# EasyEDA schematic SCH_PCB-micropad_2024-07-07.json
TITLE: Sheet_1; REV: 1.0; Date: 2024-07-03; Sheet: 1/1; Drawn By: projachmann; Company: Your Company
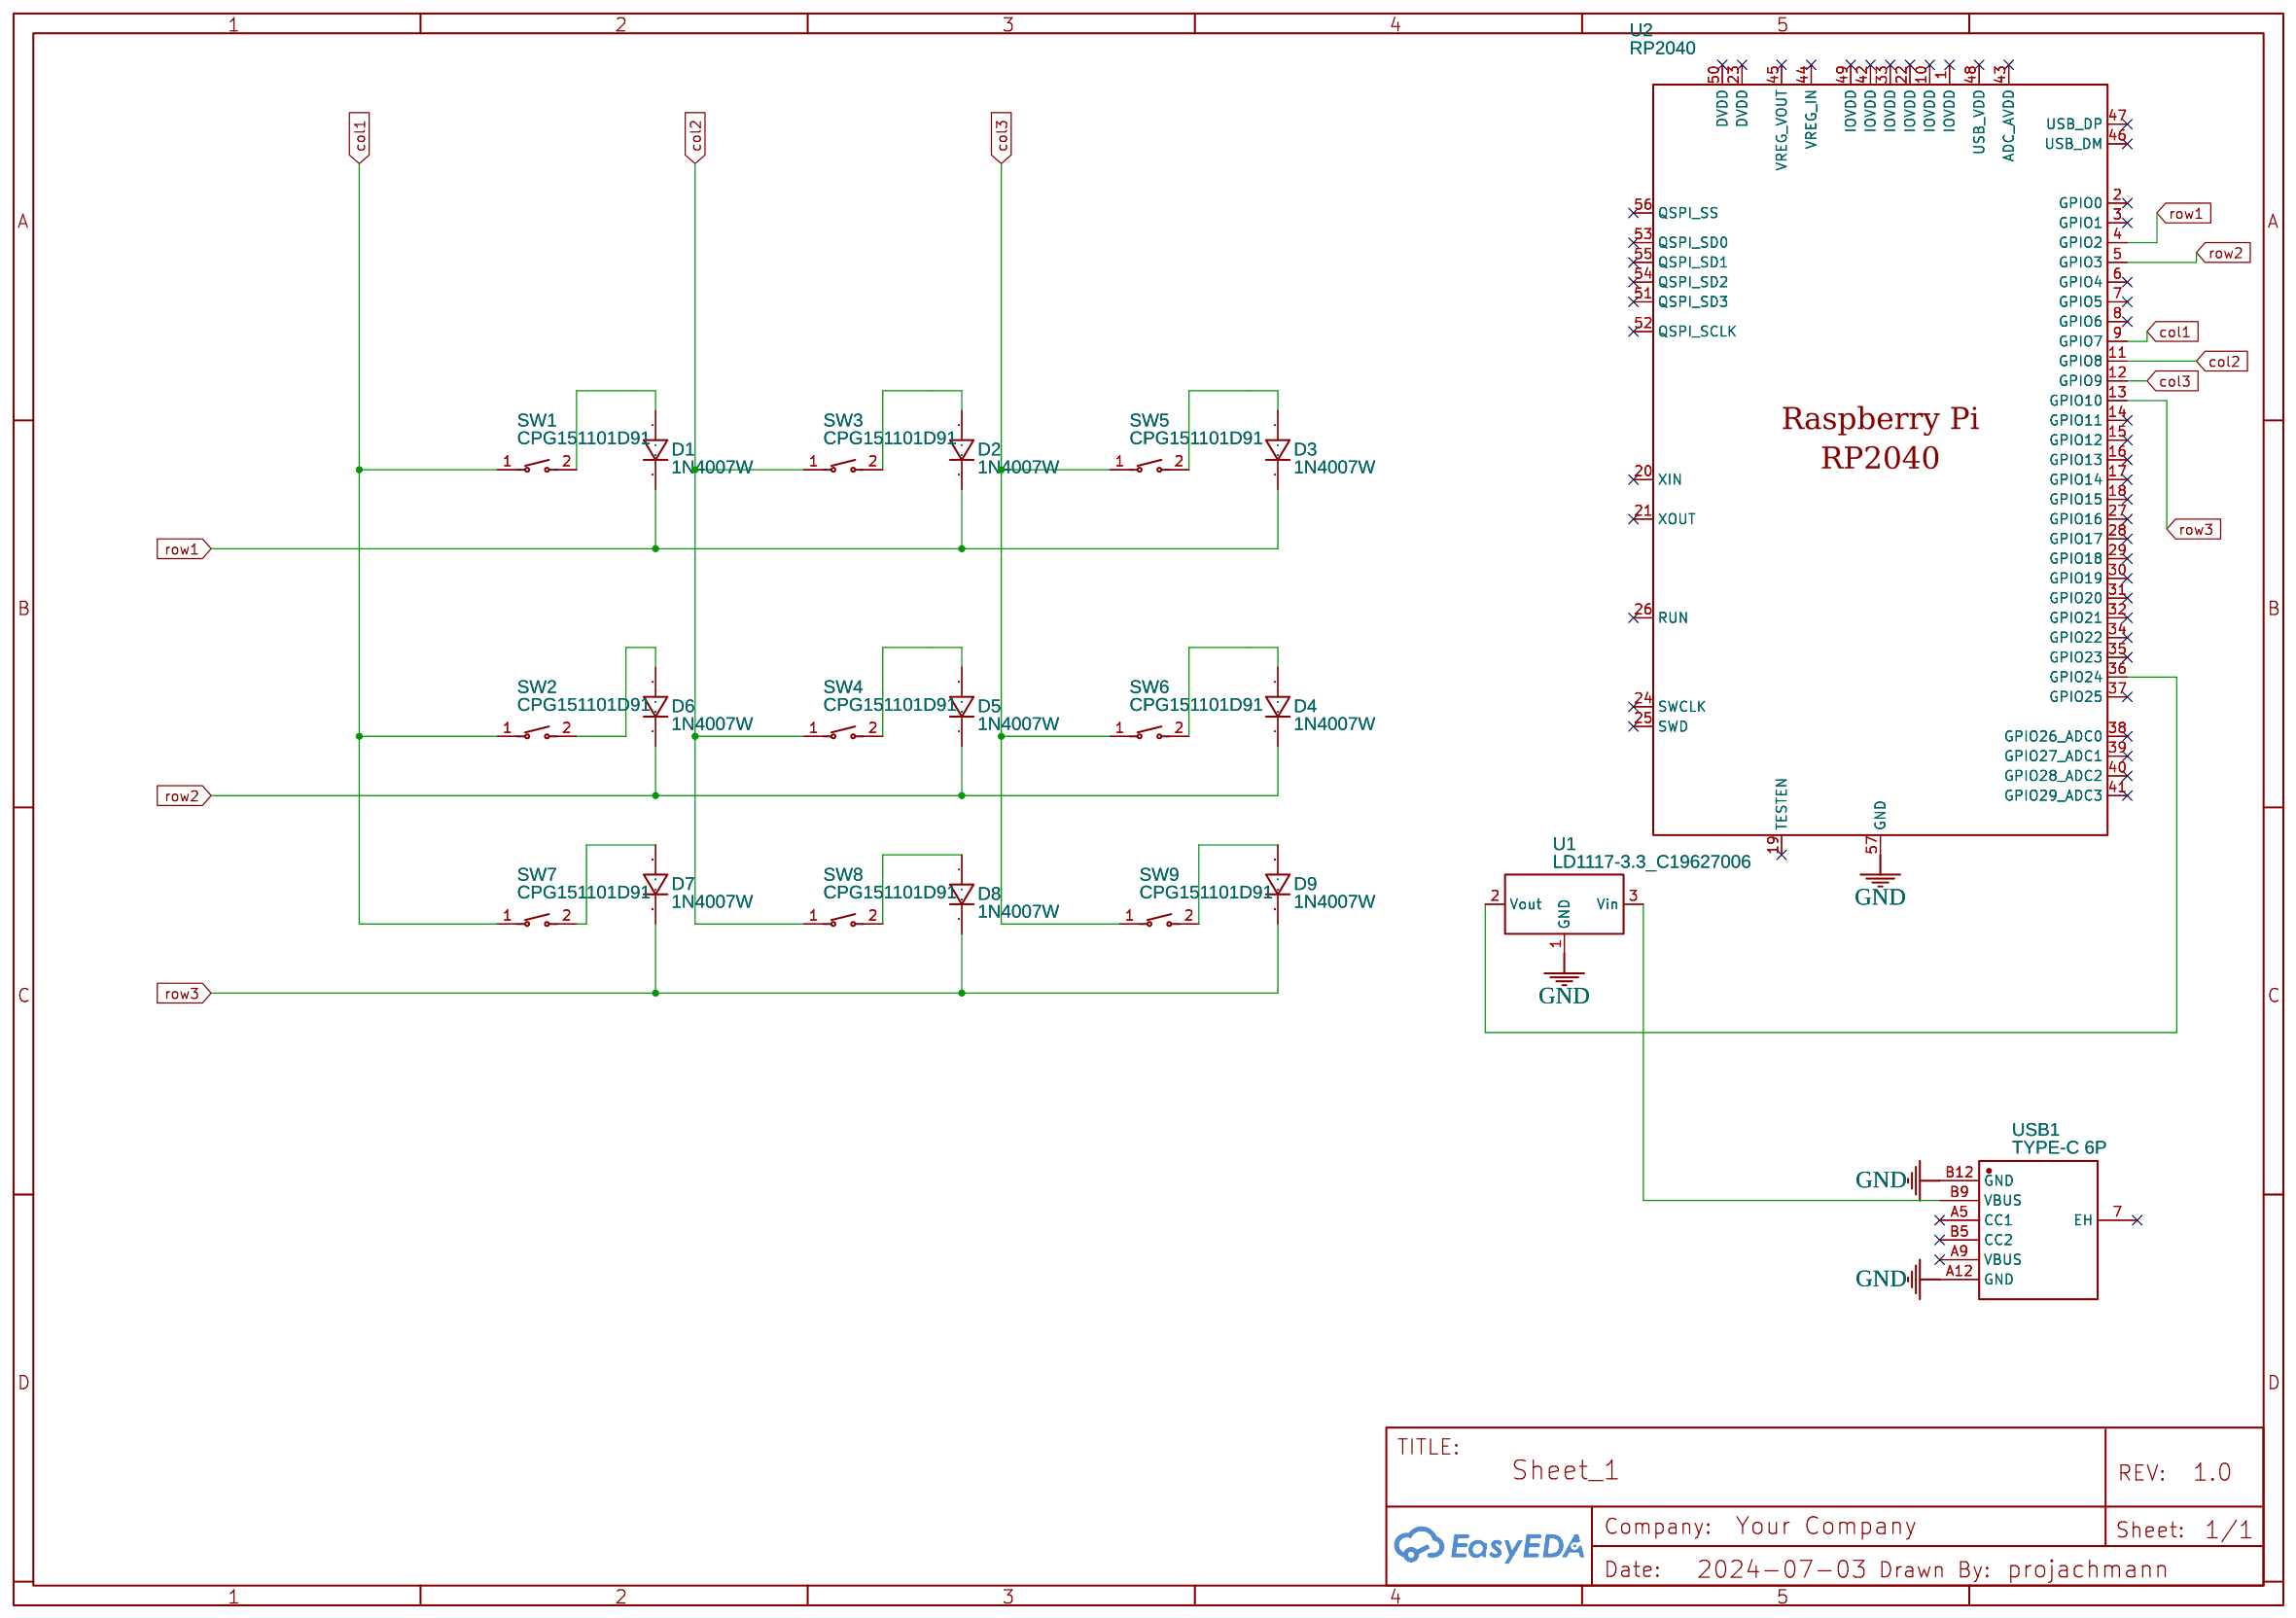
[diagram p0: schematic sheet]

## Parts
D1  1N4007W  [SOD-123_L2.8-W1.8-LS3.7-RD]
D2  1N4007W  [SOD-123_L2.8-W1.8-LS3.7-RD]
D3  1N4007W  [SOD-123_L2.8-W1.8-LS3.7-RD]
D4  1N4007W  [SOD-123_L2.8-W1.8-LS3.7-RD]
D5  1N4007W  [SOD-123_L2.8-W1.8-LS3.7-RD]
D6  1N4007W  [SOD-123_L2.8-W1.8-LS3.7-RD]
D7  1N4007W  [SOD-123_L2.8-W1.8-LS3.7-RD]
D8  1N4007W  [SOD-123_L2.8-W1.8-LS3.7-RD]
D9  1N4007W  [SOD-123_L2.8-W1.8-LS3.7-RD]
SW1  CPG151101D91  [SW-TH_CPG151101D9X]
SW2  CPG151101D91  [SW-TH_CPG151101D9X]
SW3  CPG151101D91  [SW-TH_CPG151101D9X]
SW4  CPG151101D91  [SW-TH_CPG151101D9X]
SW5  CPG151101D91  [SW-TH_CPG151101D9X]
SW6  CPG151101D91  [SW-TH_CPG151101D9X]
SW7  CPG151101D91  [SW-TH_CPG151101D9X]
SW8  CPG151101D91  [SW-TH_CPG151101D9X]
SW9  CPG151101D91  [SW-TH_CPG151101D9X]
U1  LD1117-3.3_C19627006  [SOT-223-3_L6.5-W3.4-P2.30-LS7.0-BR-1]
U2  RP2040  [LQFN-56_L7.0-W7.0-P0.4-EP]
USB1  TYPE-C 6P  [TYPE-C-SMD_TYPE-C-6P]

## Library data of the parts
D1-D9 = 1N4007W: Supplier: LCSC; Supplier Part: C328592; Manufacturer: BLUE ROCKET; Contributor: LCEDA_Lib
SW1-SW9 = CPG151101D91: Contributor: LCSC; Supplier: LCSC; Supplier Part: C400239; Manufacturer: Kailh(凯华); JLCPCB Part Class: Extended Part
U1 = LD1117-3.3_C19627006: Supplier: LCSC; Supplier Part: C19627006; Manufacturer: HXY MOSFET(华轩阳电子); Manufacturer Part: LD1117-3.3; Contributor: lcsc; JLCPCB Part Class: Extended Part
U2 = RP2040: Contributor: LCSC; Supplier: LCSC; Supplier Part: C2040; Manufacturer: Raspberry Pi(树莓派); JLCPCB Part Class: Extended Part
USB1 = TYPE-C 6P: Contributor: LCSC; Supplier: LCSC; Supplier Part: C456012; Manufacturer: SHOU HAN(首韩); JLCPCB Part Class: Extended Part

## Nets
GND: U1.1(GND) U2.57(GND) USB1.A12(GND) USB1.B12(GND)
col1: SW1.1 SW2.1 SW7.1 U2.9(GPIO7)
col2: SW3.1 SW4.1 SW8.1 U2.11(GPIO8)
col3: SW5.1 SW6.1 SW9.1 U2.12(GPIO9)
row1: D1.1 D2.1 D3.1 U2.4(GPIO2)
row2: D4.1 D5.1 D6.1 U2.5(GPIO3)
row3: D7.1 D8.1 D9.1 U2.13(GPIO10)
Net-(D1-2): D1.2 SW1.2
Net-(D2-2): D2.2 SW3.2
Net-(D3-2): D3.2 SW5.2
Net-(D4-2): D4.2 SW6.2
Net-(D5-2): D5.2 SW4.2
Net-(D6-2): D6.2 SW2.2
Net-(D7-2): D7.2 SW7.2
Net-(D8-2): D8.2 SW8.2
Net-(D9-2): D9.2 SW9.2
Net-(U1-2): U1.2(Vout) U2.36(GPIO24)
Net-(U1-3): U1.3(Vin) USB1.B9(VBUS)

Not connected (* = marked no-connect by the designer): U2 1(IOVDD)* 2(GPIO0)* 3(GPIO1)* 6(GPIO4)* 7(GPIO5)* 8(GPIO6)* 10(IOVDD)* 14(GPIO11)* 15(GPIO12)* 16(GPIO13)* 17(GPIO14)* 18(GPIO15)* 19(TESTEN)* 20(XIN)* 21(XOUT)* 22(IOVDD)* 23(DVDD)* 24(SWCLK)* 25(SWD)* 26(RUN)* 27(GPIO16)* 28(GPIO17)* 29(GPIO18)* 30(GPIO19)* 31(GPIO20)* 32(GPIO21)* 33(IOVDD)* 34(GPIO22)* 35(GPIO23)* 37(GPIO25)* 38(GPIO26_ADC0)* 39(GPIO27_ADC1)* 40(GPIO28_ADC2)* 41(GPIO29_ADC3)* 42(IOVDD)* 43(ADC_AVDD)* 44(VREG_IN)* 45(VREG_VOUT)* 46(USB_DM)* 47(USB_DP)* 48(USB_VDD)* 49(IOVDD)* 50(DVDD)* 51(QSPI_SD3)* 52(QSPI_SCLK)* 53(QSPI_SD0)* 54(QSPI_SD2)* 55(QSPI_SD1)* 56(QSPI_SS)*; USB1 7(EH)* A5(CC1)* A9(VBUS)* B5(CC2)*
